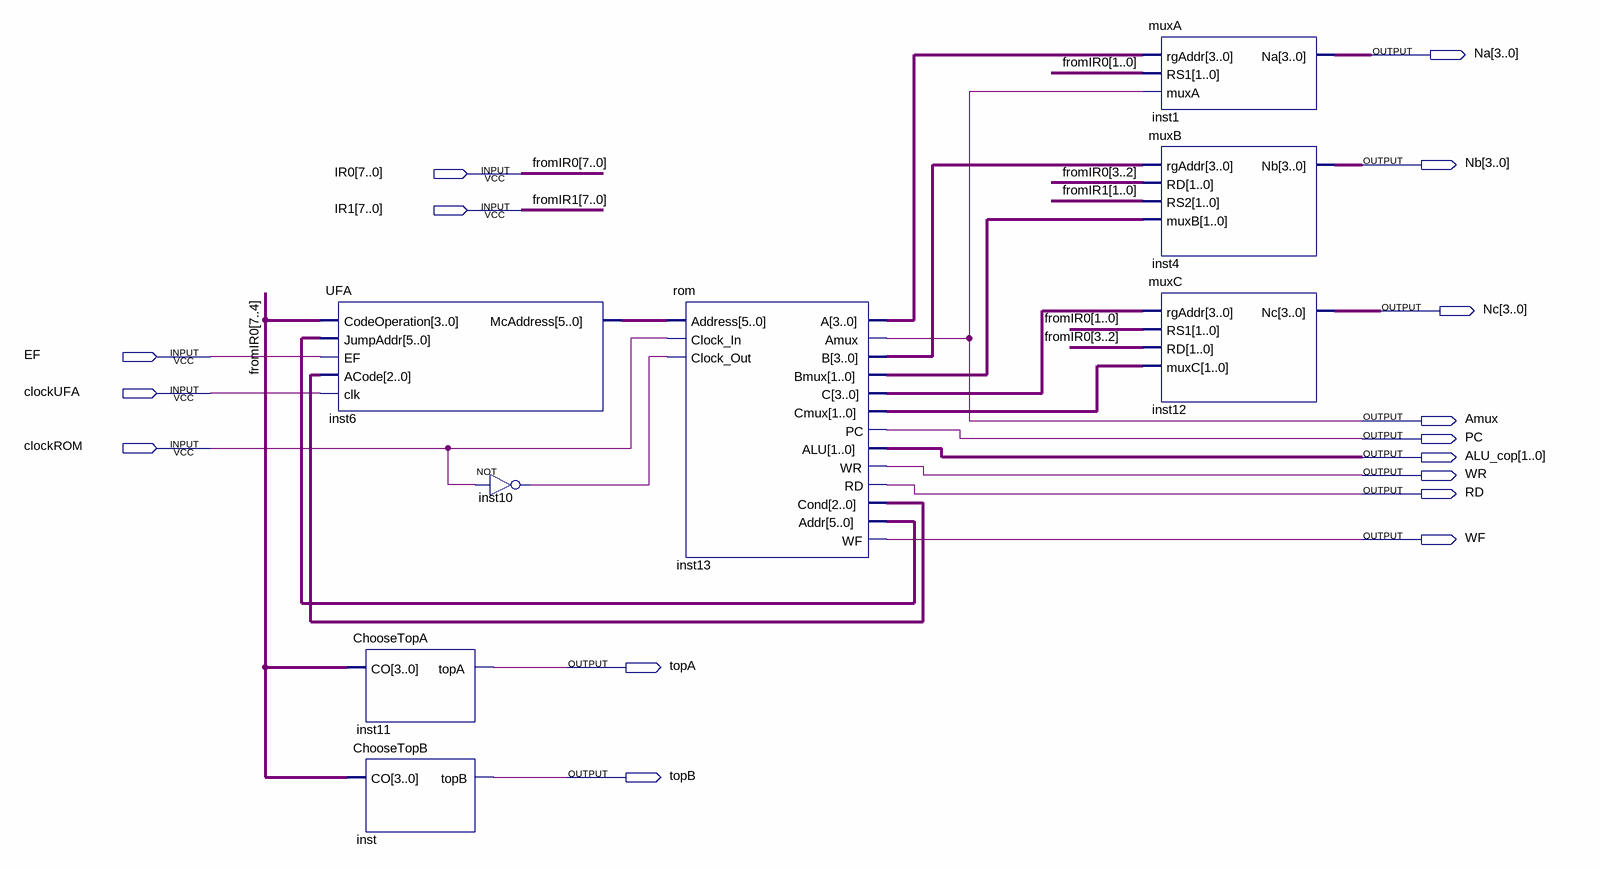
[diagram p0: schematic sheet]
// Quartus schematic CU.bdf as structural Verilog: 8 symbols, 16 pins
module CU (
  input  [7:0] IR0,
  input  [7:0] IR1,
  input  EF,
  input  clockUFA,
  input  clockROM,
  output [3:0] Na,
  output [3:0] Nb,
  output [3:0] Nc,
  output Amux,
  output PC,
  output [1:0] ALU_cop,
  output WR,
  output RD,
  output WF,
  output topA,
  output topB
);

  wire inst10_out;
  wire [1:0] inst13_bmux, inst13_cmux;
  wire [2:0] inst13_cond;
  wire [3:0] inst13_a, inst13_b, inst13_c;
  wire [5:0] inst6_mcaddress, inst13_addr;

  UFA inst6 (
    .CodeOperation(IR0[7:4]), .JumpAddr(inst13_addr), .EF(EF), .ACode(inst13_cond), .clk(clockUFA),
    .McAddress(inst6_mcaddress));
  ChooseTopA inst11 (.CO(IR0[7:4]), .topA(topA));
  ChooseTopB inst (.CO(IR0[7:4]), .topB(topB));
  not inst10 (inst10_out, clockROM);
  rom inst13 (
    .Address(inst6_mcaddress), .Clock_In(clockROM), .Clock_Out(inst10_out), .A(inst13_a), .Amux(Amux),
    .B(inst13_b), .Bmux(inst13_bmux), .C(inst13_c), .Cmux(inst13_cmux), .PC(PC), .ALU(ALU_cop), .WR(WR),
    .RD(RD), .Cond(inst13_cond), .Addr(inst13_addr), .WF(WF));
  muxA inst1 (.rgAddr(inst13_a), .RS1(IR0[1:0]), .muxA(Amux), .Na(Na));
  muxB inst4 (.rgAddr(inst13_b), .RD(IR0[3:2]), .RS2(IR1[1:0]), .muxB(inst13_bmux), .Nb(Nb));
  muxC inst12 (.rgAddr(inst13_c), .RS1(IR0[1:0]), .RD(IR0[3:2]), .muxC(inst13_cmux), .Nc(Nc));

  // Other names for the same wires on the sheet: fromIR0[7:0] = IR0; fromIR1[7:0] = IR1
endmodule
